# Altium schematic sheet Sensors.SchDoc: Sensors
size A3; Author: Valentin Py; DrawnBy: Valentin Py; Engineer: Valentin Py; Address1: valentin.py@gmail.com; SheetNumber: 2; SheetTotal: 5; PageSetup: Record=PageOptions|CenterHorizontal=True|CenterVertical=True|PrintScale=0.24|XCorrection=1.00|YCorrection=1.00|PrintKind=0|BorderSize=5000000|LeftOffset=0|BottomOffset=0|Orientation=2|PaperLength=1000|PaperWidth=1000|Scale=100|PaperSource=7|PrintQuality=-4|MediaType=1|DitherType=10|PaperKind=A4|PrintScaleMode=1
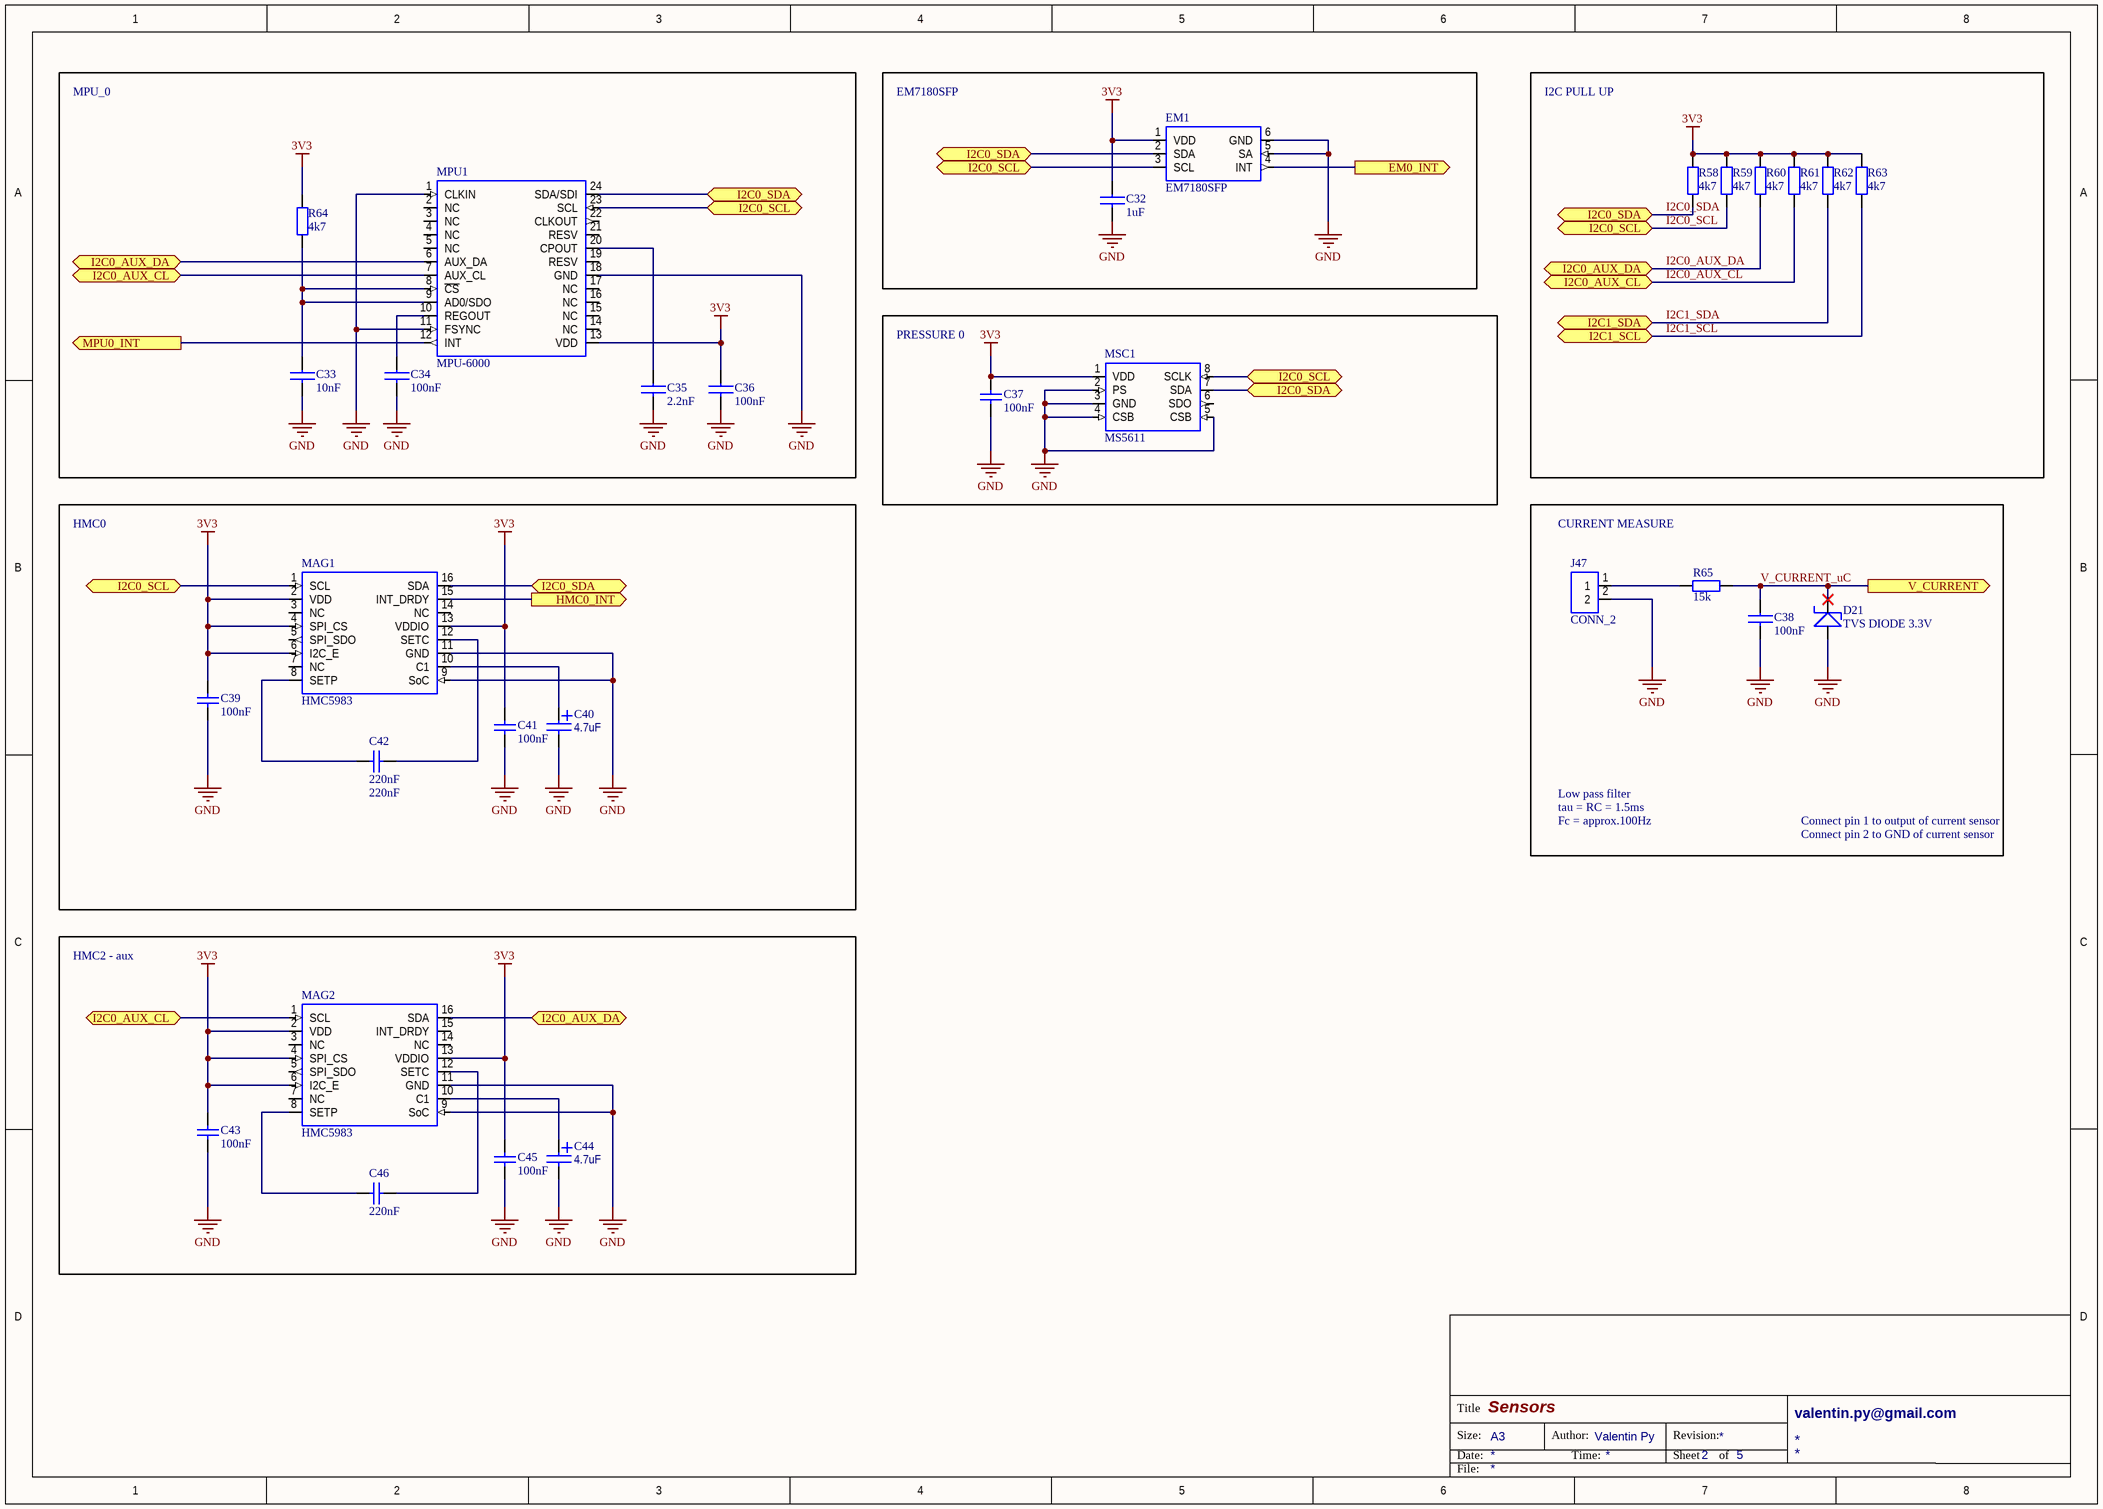
[diagram p0: Sensors.SchDoc]

## Parts
C32  1uF  [080503]
C33  10nF  [080503]
C34  100nF  [080503]
C35  2.2nF  [080503]
C36  100nF  [080503]
C37  100nF  [080503]
C38  100nF  [080503]
C39  100nF  [080503]
C40  4.7uF  [120605]
C41  100nF  [080503]
C42  220nF  [080503]
C43  100nF  [080503]
C44  4.7uF  [120605]
C45  100nF  [080503]
C46  220nF  [080503]
D21  TVS DIODE 3.3V  [SOD-523]
EM1  EM7180SFP  [EM7180SFP]
J47  CONN_2  [640454-2]
MAG1  HMC5983  [QFN16]
MAG2  HMC5983  [QFN16]
MPU1  MPU-6000  [QFN24]
MSC1  MS5611  [MS5611]
R58  4k7  [060301]
R59  4k7  [060301]
R60  4k7  [060301]
R61  4k7  [060301]
R62  4k7  [060301]
R63  4k7  [060301]
R64  4k7  [060301]
R65  15k  [060301]

## Blocks framed on the sheet
MPU_0: C33-C36 MPU1 R64
EM7180SFP: C32 EM1
I2C PULL UP: R58-R63
PRESSURE 0: C37 MSC1
HMC0: C39-C42 MAG1
HMC2 - aux: C43-C46 MAG2

## Ports
EM0_INT (out), HMC0_INT (out), I2C0_AUX_CL (bidir), I2C0_AUX_DA (bidir), I2C0_SCL (bidir), I2C0_SDA (bidir), I2C1_SCL, I2C1_SDA, MPU0_INT (out), V_CURRENT (out)

## Nets
3V3: C32.1 C36.1 C37.2 C39.1 C41.1 C43.1 C45.1 EM1.1(VDD) MAG1.2(VDD) MAG1.4(SPI_CS) MAG1.6(I2C_E) MAG1.13(VDDIO) MAG2.2(VDD) MAG2.4(SPI_CS) MAG2.6(I2C_E) MAG2.13(VDDIO) MPU1.13(VDD) MSC1.1(VDD) R58.2 R59.2 R60.2 R61.2 R62.2 R63.2 R64.2
GND: C32.2 C33.2 C34.2 C35.2 C36.2 C37.1 C38.2 C39.2 C40.2 C41.2 C43.2 C44.2 C45.2 D21.1 EM1.5(SA) EM1.6(GND) J47.2 MAG1.9(SoC) MAG1.11(GND) MAG2.9(SoC) MAG2.11(GND) MPU1.1(CLKIN) MPU1.11(FSYNC) MPU1.18(GND) MSC1.2(PS) MSC1.3(GND) MSC1.4(CSB) MSC1.5(CSB)
EM0_INT: EM1.4(INT) ; port EM0_INT
HMC0_INT: MAG1.15(INT_DRDY) ; port HMC0_INT
I2C0_AUX_CL: MAG2.1(SCL) MPU1.7(AUX_CL) R61.1 ; port I2C0_AUX_CL
I2C0_AUX_DA: MAG2.16(SDA) MPU1.6(AUX_DA) R60.1 ; port I2C0_AUX_DA
I2C0_SCL: EM1.3(SCL) MAG1.1(SCL) MPU1.23(SCL) MSC1.8(SCLK) R59.1 ; port I2C0_SCL
I2C0_SDA: EM1.2(SDA) MAG1.16(SDA) MPU1.24(SDA/SDI) MSC1.7(SDA) R58.1 ; port I2C0_SDA
I2C1_SCL: R63.1 ; port I2C1_SCL
I2C1_SDA: R62.1 ; port I2C1_SDA
MPU0_INT: MPU1.12(INT) ; port MPU0_INT
V_CURRENT_uC: C38.1 D21.2 R65.2 ; port V_CURRENT
NetC33_1: C33.1 MPU1.8(~{CS}) MPU1.9(AD0/SDO) R64.1
NetC34_1: C34.1 MPU1.10(REGOUT)
NetC35_1: C35.1 MPU1.20(CPOUT)
NetC40_1: C40.1 MAG1.10(C1)
NetC42_1: C42.1 MAG1.12(SETC)
NetC42_2: C42.2 MAG1.8(SETP)
NetC44_1: C44.1 MAG2.10(C1)
NetC46_1: C46.1 MAG2.12(SETC)
NetC46_2: C46.2 MAG2.8(SETP)
NetJ47_1: J47.1 R65.1

Not connected (* = marked no-connect by the designer): MAG1 3(NC) 5(SPI_SDO) 7(NC) 14(NC); MAG2 3(NC) 5(SPI_SDO) 7(NC) 14(NC) 15(INT_DRDY); MPU1 2(NC) 3(NC) 4(NC) 5(NC) 14(NC) 15(NC) 16(NC) 17(NC) 19(RESV) 21(RESV) 22(CLKOUT); MSC1 6(SDO)

## Notes on the sheet
- CURRENT MEASURE
- Low pass filter
- tau = RC = 1.5ms
- Fc = approx.100Hz
- Connect pin 1 to output of current sensor
- Connect pin 2 to GND of current sensor
- Title
- Size:
- Date:
- A3
- Author:
- Time:
- Revision:
- Sheet
- of
- File:

## Library data of the parts
C32 = CAPA: CAP CER 1UF 25V 10% X7R 0805; Value: 1uF; Supplier 1: Digi-Key; Supplier Part Number 1: 399-1168-1-ND
C33 = CAPA: CAP CER 10nF 50V 10% X7R 0805; Value: 10nF; Supplier 1: Digi-Key; Supplier Part Number 1: 399-1158-1-ND
C34 C36 C38 = CAPA: CAP CER 0.1UF 25V 10% X7R 0805; Value: 100nF; Supplier 1: Digi-Key; Supplier Part Number 1: 1276-1099-1-ND
C35 = CAPA: CAP CER 2.2nF 50V; Value: 2.2nF; Supplier 1: Digi-Key; Supplier Part Number 1: 399-11167-2-ND
C37 C39 C41 C43 C45 = CAP: CAP CER 0.1UF 25V 10% X7R 0805; Value: 100nF; Supplier 1: Digi-Key; Supplier Part Number 1: 1276-1099-1-ND
C40 C44 = CAPA_T: CAP TANT 4.7uF 10V 10% 1206; Value: 4.7uF; Supplier 1: Digi-Key; Supplier Part Number 1: 399-3696-1-ND
C42 C46 = CAP: CAP CER 0.22uF 50V X7R 10% 0805; Value: 220nF; Supplier 1: Digi-Key; Supplier Part Number 1: 399-3491-1-ND
D21 = Zener: TVS DIODE 3.3VWM 8VC SOD523; Supplier 1: Digi-Key; Supplier Part Number 1: 641-1395-1-ND
J47 = CONN_2: CONN HEADER 2.54mm 2; Supplier 1: Stock
MAG1 MAG2 = HMC5983: IC COMPASS 3 AXIS 16-LCC; Supplier 1: Digi-Key; Supplier Part Number 1: 342-1092-1-ND
MPU1 = MPU-6000: GYRO/ACCELEROMETER 6AXIS 24QFN; Supplier 1: Digi-Key; Supplier Part Number 1: 1428-1005-1-ND
R58-R64 = RES: RES 4.7K 0805; Value: 4k7; Supplier 1: Digi-Key; Supplier Part Number 1: RMCF0603FT4K70CT-ND
R65 = RES: RES 15K 0805; Value: 15k; Supplier 1: Digi-Key; Supplier Part Number 1: RHM15.0KCFCT-ND